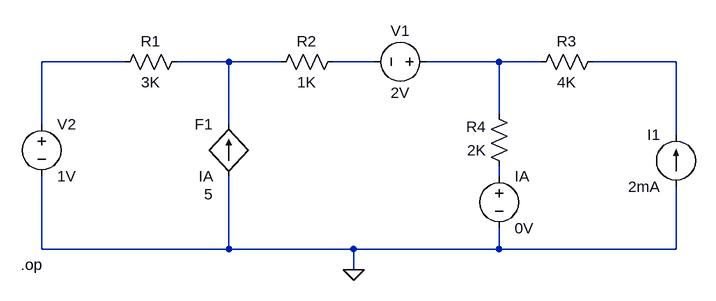
[diagram p0: schematic 26263880L.asc]
26263880L.asc, the LTspice schematic file:
Version 4
SHEET 1 948 680
WIRE 64 64 -64 64
WIRE 224 64 144 64
WIRE 304 64 224 64
WIRE 448 64 384 64
WIRE 640 64 528 64
WIRE 704 64 640 64
WIRE 912 64 784 64
WIRE 640 144 640 64
WIRE -64 160 -64 64
WIRE 224 160 224 64
WIRE 912 176 912 64
WIRE 640 240 640 224
WIRE -64 352 -64 240
WIRE 224 352 224 240
WIRE 224 352 -64 352
WIRE 416 352 224 352
WIRE 640 352 640 320
WIRE 640 352 416 352
WIRE 912 352 912 256
WIRE 912 352 640 352
WIRE 416 384 416 352
FLAG 416 384 0
SYMBOL res 160 48 R90
WINDOW 0 0 56 VBottom 2
WINDOW 3 32 56 VTop 2
SYMATTR InstName R1
SYMATTR Value 3K
SYMBOL res 400 48 R90
WINDOW 0 0 56 VBottom 2
WINDOW 3 32 56 VTop 2
SYMATTR InstName R2
SYMATTR Value 1K
SYMBOL voltage 544 64 R90
WINDOW 0 -32 56 VBottom 2
WINDOW 3 32 56 VTop 2
WINDOW 123 0 0 Left 0
WINDOW 39 0 0 Left 0
SYMATTR InstName V1
SYMATTR Value 2V
SYMBOL voltage -64 144 R0
WINDOW 123 0 0 Left 0
WINDOW 39 0 0 Left 0
SYMATTR InstName V2
SYMATTR Value 1V
SYMBOL res 800 48 R90
WINDOW 0 0 56 VBottom 2
WINDOW 3 32 56 VTop 2
SYMATTR InstName R3
SYMATTR Value 4K
SYMBOL res 656 240 R180
WINDOW 0 36 76 Left 2
WINDOW 3 36 40 Left 2
SYMATTR InstName R4
SYMATTR Value 2K
SYMBOL current 912 256 R180
WINDOW 0 24 80 Left 2
WINDOW 3 24 0 Left 2
WINDOW 123 0 0 Left 0
WINDOW 39 0 0 Left 0
SYMATTR InstName I1
SYMATTR Value 2mA
SYMBOL voltage 640 224 R0
WINDOW 123 0 0 Left 0
WINDOW 39 0 0 Left 0
SYMATTR InstName IA
SYMATTR Value 0V
SYMBOL f 224 240 R180
WINDOW 0 24 80 Left 2
WINDOW 3 24 0 Left 2
WINDOW 123 24 -28 Left 2
SYMATTR InstName F1
SYMATTR Value IA
SYMATTR Value2 5
TEXT -96 376 Left 2 !.op

The netlist it stands for:
* 26263880L.asc
R1 N002 N001 3K
R2 N003 N002 1K
V1 N004 N003 2V
V2 N001 0 1V
R3 N005 N004 4K
R4 N006 N004 2K
I1 0 N005 2mA
V§IA N006 0 0V
F1 0 N002 IA 5
.op
.backanno
.end